# Altium schematic sheet SD Card Selection Multiplexer.SchDoc: SD/ICSP Selection Multiplexer
size A4; SheetNumber: 19; SheetTotal: 37
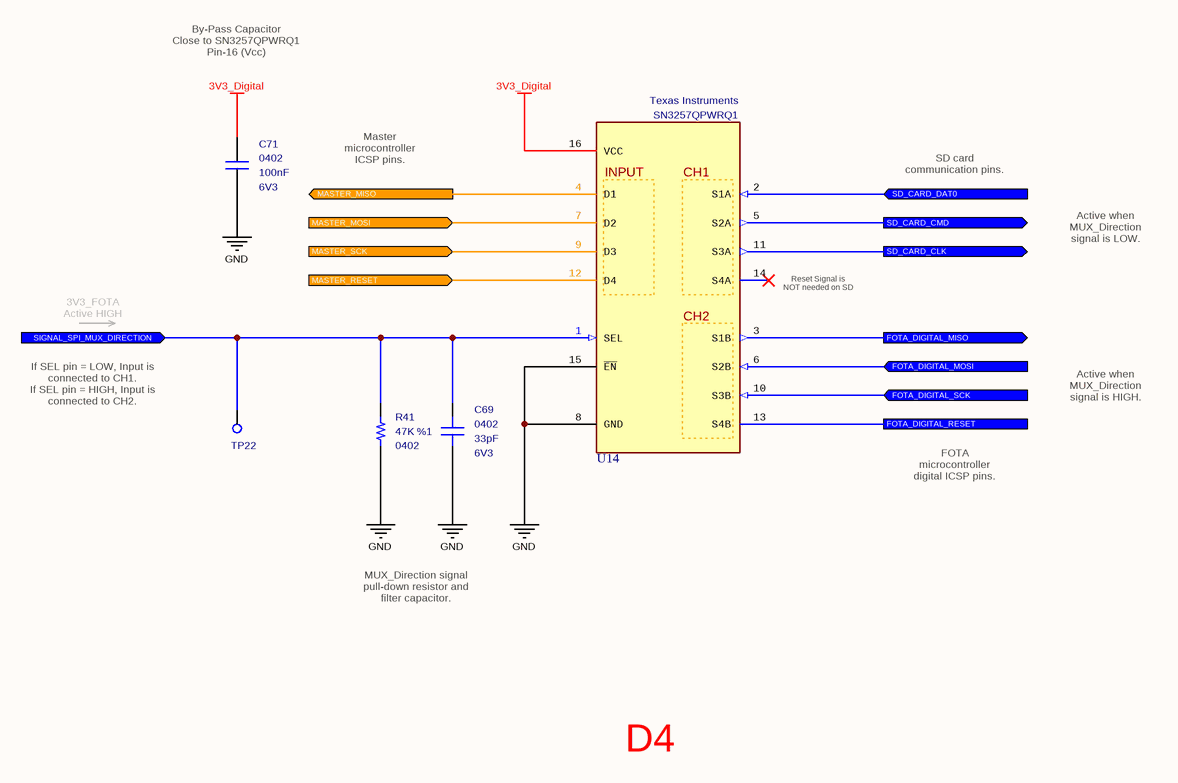
[diagram p0: SD Card Selection Multiplexer.SchDoc]

## Parts
C69  value 33pF  Case: 0402  Voltage: 6V3  [CAPACITOR_0402]  (hidden comment: Multilayer Ceramic Capacitor)
C71  value 100nF  Case: 0402  Voltage: 6V3  [CAPACITOR_0402]  (hidden comment: Multilayer Ceramic Capacitor)
R41  value 47K  Tolerance: %1  Case: 0402  [RESISTOR_0402]  (hidden comment: Thick Film Resistor)
TP22  PCB - Test Point  [Test_Pad - Hole]  (value not drawn)  (no BOM)
U14  Manufacturer_Part_Number: SN3257QPWRQ1  Manufacturer_Name: Texas Instruments  [TSSOP-16]  (hidden comment: SPI Switch IC)

## Ports
FOTA_DIGITAL_MISO (out), FOTA_DIGITAL_MOSI (in), FOTA_DIGITAL_RESET, FOTA_DIGITAL_SCK (in), MASTER_MISO (out), MASTER_MOSI (in), MASTER_RESET (in), MASTER_SCK (in), SD_CARD_CLK (out), SD_CARD_CMD (out), SD_CARD_DAT0 (in), SIGNAL_SPI_MUX_DIRECTION (in)

## Nets
3V3_Digital: C71.1 U14.16(VCC)
GND: C69.1 C71.2 R41.1 U14.8(GND) U14.15(~{EN})
FOTA_DIGITAL_MISO: U14.3(S1B) ; port FOTA_DIGITAL_MISO
FOTA_DIGITAL_MOSI: U14.6(S2B) ; port FOTA_DIGITAL_MOSI
FOTA_DIGITAL_RESET: U14.13(S4B) ; port FOTA_DIGITAL_RESET
FOTA_DIGITAL_SCK: U14.10(S3B) ; port FOTA_DIGITAL_SCK
MASTER_MISO: U14.4(D1) ; port MASTER_MISO
MASTER_MOSI: U14.7(D2) ; port MASTER_MOSI
MASTER_RESET: U14.12(D4) ; port MASTER_RESET
MASTER_SCK: U14.9(D3) ; port MASTER_SCK
SD_CARD_CLK: U14.11(S3A) ; port SD_CARD_CLK
SD_CARD_CMD: U14.5(S2A) ; port SD_CARD_CMD
SD_CARD_DAT0: U14.2(S1A) ; port SD_CARD_DAT0
SIGNAL_SPI_MUX_DIRECTION: C69.2 R41.2 TP22.1 U14.1(SEL) ; port SIGNAL_SPI_MUX_DIRECTION

Not connected (* = marked no-connect by the designer): U14 14(S4A)*

## Notes on the sheet
- By-Pass Capacitor
  Close to SN3257QPWRQ1
  Pin-16 (Vcc)
- Master microcontroller ICSP pins.
- SD card communication pins.
- Active when MUX_Direction signal is LOW.
- 3V3_FOTA
  Active HIGH
- (near U14) Reset Signal is NOT needed on SD card.
- If SEL pin = LOW, Input is connected to CH1.
  If SEL pin = HIGH, Input is connected to CH2.
- Active when MUX_Direction signal is HIGH.
- FOTA microcontroller digital ICSP pins.
- MUX_Direction signal pull-down resistor and filter capacitor.
- D4
- Title
- Size:
- Date:
- A4
- Number:
- Time:
- Revision:
- Sheet
- of
- File:
- (in symbol IC - SN3257QPWRQ1) INPUT; CH1; CH2

## Library data of the parts
C69 = Capacitor - 33pF [0402-6V3]: Capacitor - 33pF [0402] (Ceramic); Manufacturer_Name: Kemet; Manufacturer_Part_Number: C0402C330J9RACAUTO; Dielectric: X7R; Tolerance: 10%; Height: 0.5mm; Mouser_Part_Number: 80-C0402C330J9RAUTO; Maximum Operating Temperature: +125; Minimum Operating Temperature: -55; ROHS: Yes; ComponentLink1Description: DataSheet; ComponentLink1URL: https://api.kemet.com/component-edge/download/datasheet/C0402C330J9RACAUTO.pdf; ComponentLink2Description: Mouser; ComponentLink2URL: https://www.mouser.com/Search/Refine.aspx?Keyword=80-C0402C330J9RAUTO; Supplier 1: Mouser; Supplier Part Number 1: 80-C0402C330J9RAUTO
C71 = Capacitor - 100nF [0402-6V3]: Capacitor - 100nF [0402-6V3] (Ceramic); Manufacturer_Name: AVX; Manufacturer_Part_Number: 04026D104KAT4A; Dielectric: X5R; Tolerance: %10; Height: 0.25mm; Mouser_Part_Number: 581-04026D104KAT4A; ComponentLink1Description: Mouser; ComponentLink1URL: https://www.mouser.com.tr/ProductDetail/AVX/04026D104KAT4A?qs=sGAEpiMZZMs0AnBnWHyRQPg4iYkCw7IMED%2F4kpqgf7w%3D; ComponentLink2Description: DataSheet; ComponentLink2URL: https://www.mouser.com.tr/datasheet/2/40/cx5r-776519.pdf; ROHS: Yes; Maximum Operating Temperature: +85; Minimum Operating Temperature: -55; Supplier 1: Avnet; Supplier Part Number 1: 04026D104KAT4A
R41 = Resistor - 47K: Thick Film Resistors - SMD 1/16 W 47 Kohms 1%; Manufacturer_Name: Vishay; Manufacturer_Part_Number: CRCW040247K0FKED; Height: 0.4mm; Mouser_Part_Number: 71-CRCW0402-47K-E3; ComponentLink1Description: DataSheet; ComponentLink1URL: https://www.mouser.com.tr/datasheet/2/427/dcrcwe3-1762152.pdf; ComponentLink2Description: Mouser; ComponentLink2URL: https://www.mouser.com.tr/ProductDetail/Vishay-Dale/CRCW040247K0FKED?qs=sGAEpiMZZMu61qfTUdNhG2DpbjADlD3GL%252B3h1elTxqU%3D; Supplier 1: Mouser; Supplier 2: Digi-Key; Supplier Part Number 1: 71-CRCW040247K0FKEDH; Supplier Part Number 2: 541-47.0KYCT-ND
TP22 = PCB - Test Point: Test Point
U14 = IC - SN3257QPWRQ1: Analogue Switch ICs 2:1 (SPDT), 4-channel switch with 1.8-V logic 16-TSSOP -40 to 125; Mouser Part Number: 595-SN3257QPWRQ1; ComponentLink1Description: DataSheet; ComponentLink1URL: http://www.ti.com/lit/ds/symlink/tca9546a.pdf; ComponentLink2Description: Mouser; ComponentLink2URL: https://eu.mouser.com/ProductDetail/Texas-Instruments/TCA9546APWR?qs=sGAEpiMZZMu0f%252BT2bkVfuqY85%252BzcFu6eZaMCXRqwDMg%3D; Minimum Operating Temperature: -40; Maximum Operating Temperature: +125; Supplier 1: Mouser; Supplier 2: Digi-Key; Supplier Part Number 1: 595-SN3257QPWRQ1; Supplier Part Number 2: 296-SN3257QPWRQ1CT-ND; Case: TSSOP-16